# Altium schematic sheet others.SchDoc
size A4; SheetNumber: 6; SheetTotal: 6
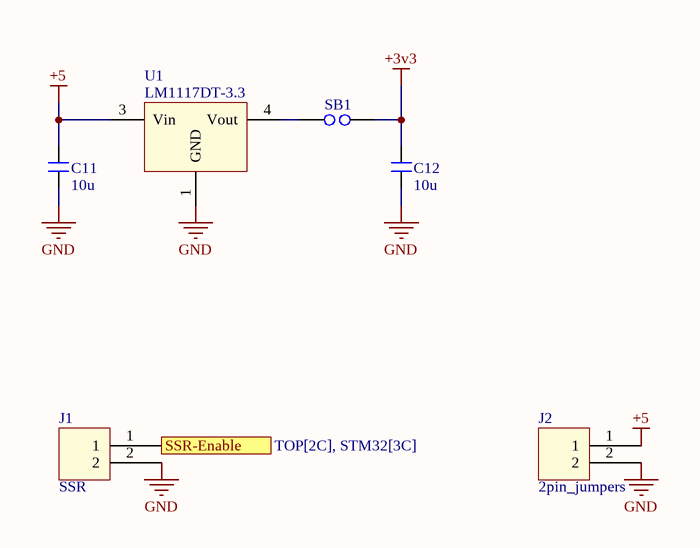
[diagram p0: others.SchDoc]

## Parts
C11  10u  [0805]
C12  10u  [0805]
J1  SSR  [2pin]
J2  2pin_jumpers  [2pinpwd]
SB1  SolderBrige  [SolderBrige]  (value not drawn)
U1  LM1117DT-3.3  [LM1117DT-3.3]

## Ports
SSR-Enable (in, see TOP[2C], STM32[3C])

## Nets
+3v3: C12.1 SB1.1
+5: C11.1 J2.1 U1.3(Vin)
GND: C11.2 C12.2 J1.2 J2.2 U1.1(GND)
SSR-Enable: J1.1 ; port SSR-Enable
NetSB1_2: SB1.2 U1.4(Vout)

## Library data of the parts
C11 C12 = capacitor